# EAGLE design PowerDistribution (EAGLE 9.5.0)

## Sheet 1 of 3: Connectors
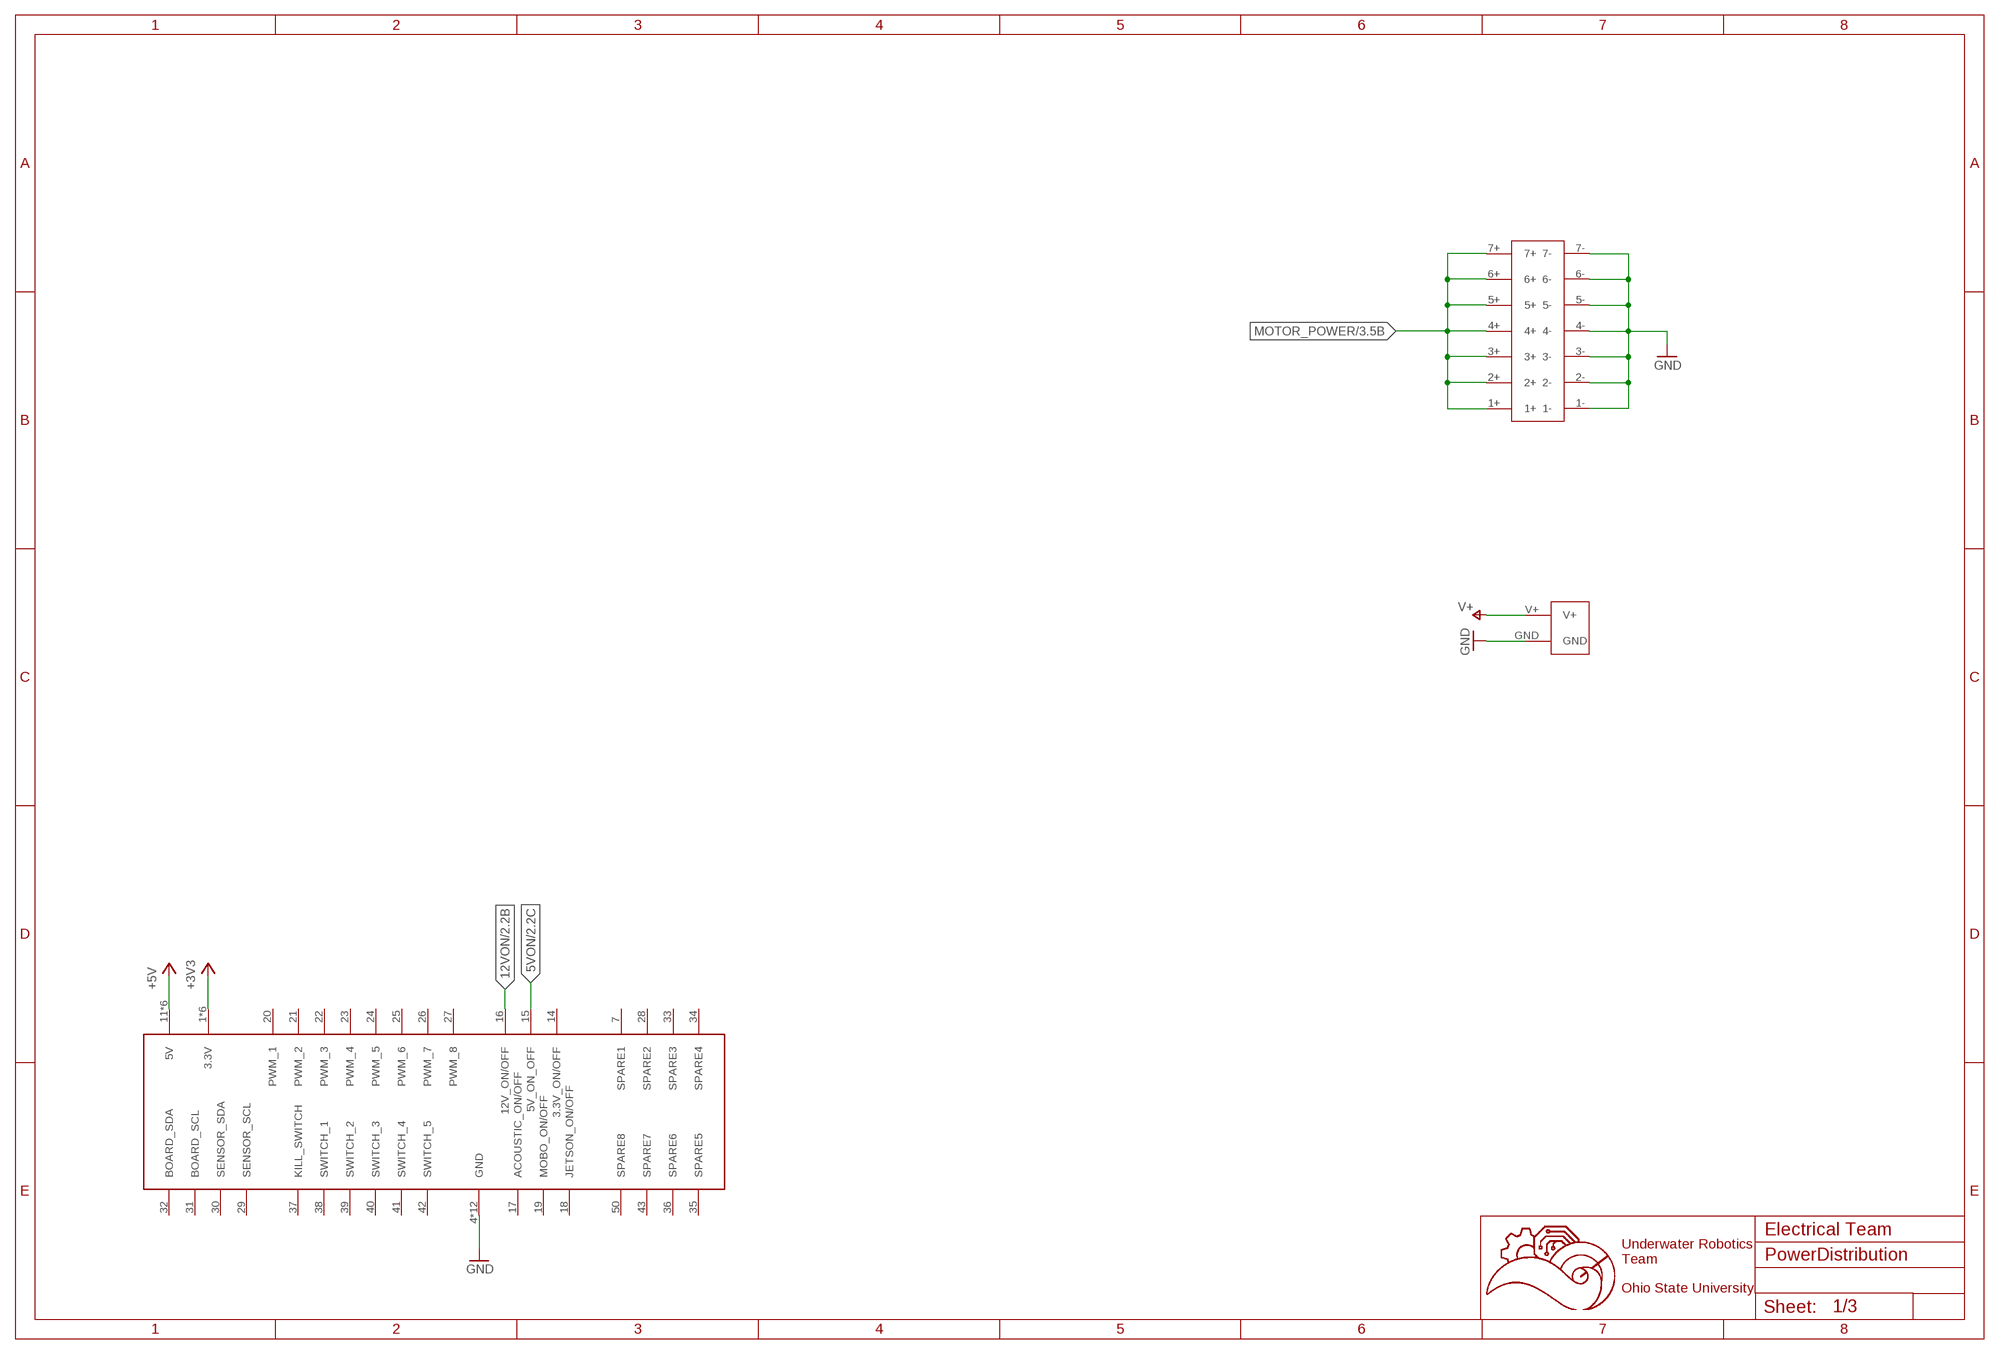
[diagram p0: schematic, sheet 1]

### Parts
U$1  5530843-EDGE  [5530843-6-BOARDFINGERS]
U$2  XT90PWH  [XT90PWH]
U$4  14PIN-VERT  [14PIN_VERT]

### Nets
5VON: U$1.15(5V_ON_OFF) ; also sheet 2
12VON: U$1.16(12V_ON/OFF) ; also sheet 2
+3V3: U$1.1(3.3V) U$1.2(3.3V) U$1.3(3.3V) U$1.54(3.3V) U$1.55(3.3V) U$1.56(3.3V) ; also sheet 2,3
+5V: U$1.11(5V) U$1.12(5V) U$1.13(5V) U$1.44(5V) U$1.45(5V) U$1.46(5V) ; also sheet 2
GND: U$1.4(GND) U$1.5(GND) U$1.6(GND) U$1.8(GND) U$1.9(GND) U$1.10(GND) U$1.47(GND) U$1.48(GND) U$1.49(GND) U$1.51(GND) U$1.52(GND) U$1.53(GND) U$2.GND U$4.1- U$4.2- U$4.3- U$4.4- U$4.5- U$4.6- U$4.7- ; also sheet 2
MOTOR_POWER: U$4.1+ U$4.2+ U$4.3+ U$4.4+ U$4.5+ U$4.6+ U$4.7+ ; also sheet 3
V+: U$2.V+ ; also sheet 2,3
Unconnected: U$1.7(SPARE1) U$1.14(3.3V_ON/OFF) U$1.17(ACOUSTIC_ON/OFF) U$1.18(JETSON_ON/OFF) U$1.19(MOBO_ON/OFF) U$1.20(PWM_1) U$1.21(PWM_2) U$1.22(PWM_3) U$1.23(PWM_4) U$1.24(PWM_5) U$1.25(PWM_6) U$1.26(PWM_7) U$1.27(PWM_8) U$1.28(SPARE2) U$1.29(SENSOR_SCL) U$1.30(SENSOR_SDA) U$1.31(BOARD_SCL) U$1.32(BOARD_SDA) U$1.33(SPARE3) U$1.34(SPARE4) U$1.35(SPARE5) U$1.36(SPARE6) U$1.37(KILL_SWITCH) U$1.38(SWITCH_1) U$1.39(SWITCH_2) U$1.40(SWITCH_3) U$1.41(SWITCH_4) U$1.42(SWITCH_5) U$1.43(SPARE7) U$1.50(SPARE8)

### Notes on the sheet
- Electrical Team
- Underwater Robotics
  Team
  
  Ohio State University

## Sheet 2 of 3: Converters
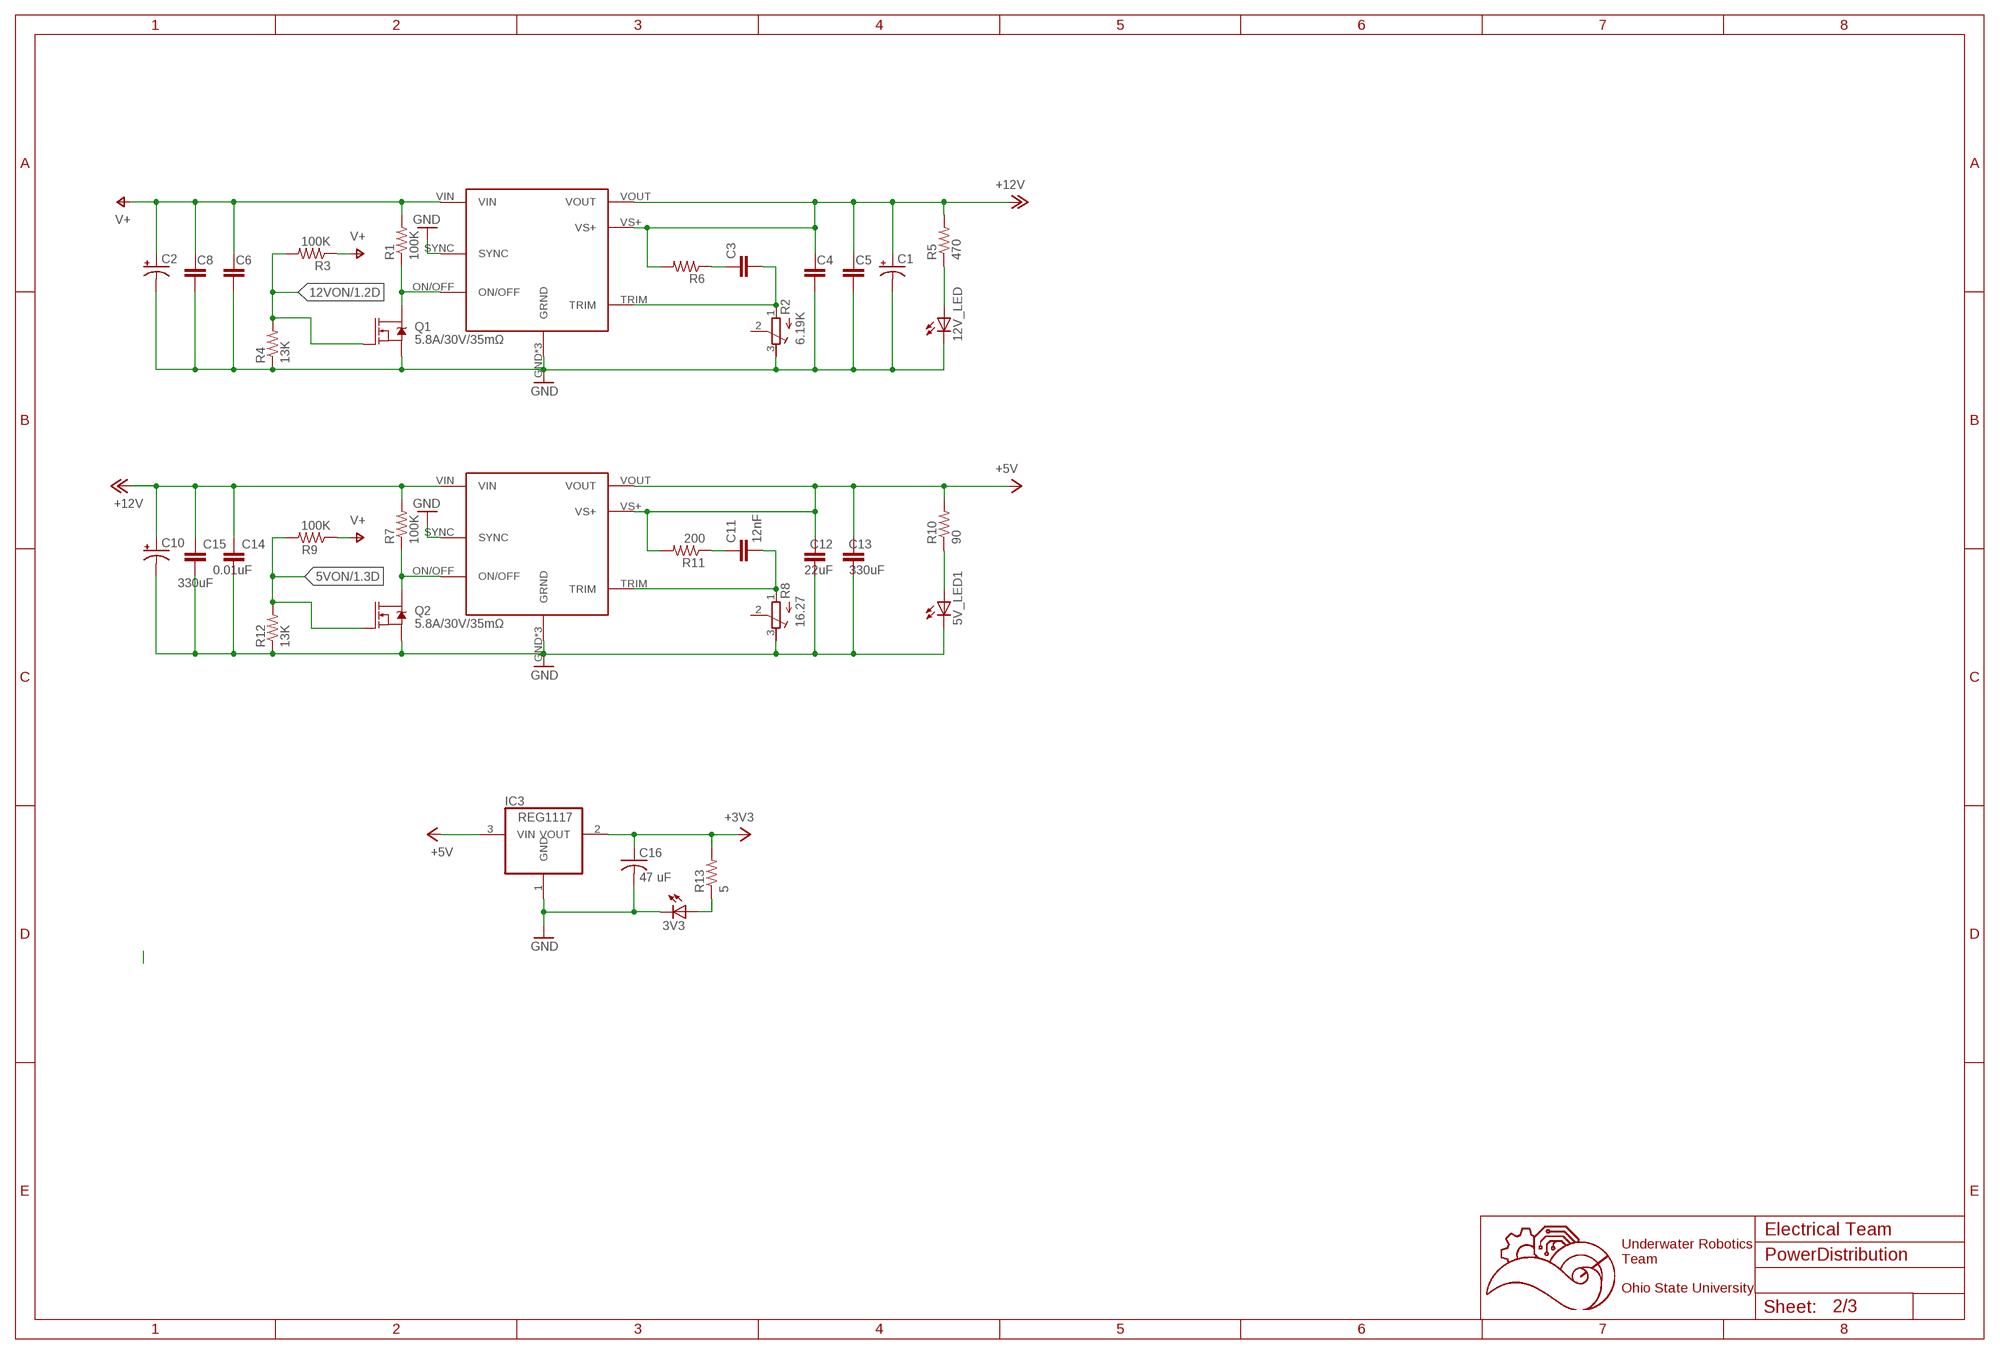
[diagram p1: schematic, sheet 2]

### Parts
3V3  LEDCHIPLED_0603  [CHIPLED_0603]
5V_LED1  LEDCHIPLED_0603  [CHIPLED_0603]
12V_LED  LEDCHIPLED_0603  [CHIPLED_0603]
C1  CPOL-USE5-10.5  [E5-10,5]
C2  47uF  CPOL-USE5-10.5  [E5-10,5]
C3  1.5nF  C-EUC0603  [C0603]
C4  22uF  C-EUC0603  [C0603]
C5  470uF  C-EUC0603  [C0603]
C6  0.01uF  C-EUC0603  [C0603]
C8  C-EUC0603  [C0603]
C10  47uF  CPOL-USE5-10.5  [E5-10,5]
C11  12nF  C-EUC0603  [C0603]
C12  22uF  C-EUC0603  [C0603]
C13  330uF  C-EUC0603  [C0603]
C14  0.01uF  C-EUC0603  [C0603]
C15  330uF  C-EUC0603  [C0603]
C16  47 uF  C-USC1206K  [C1206K]
IC3  REG1117  [SOT223]
Q1  5.8A/30V/35mΩ  MOSFET-NCH-AO3404A  [SOT23-3]
Q2  5.8A/30V/35mΩ  MOSFET-NCH-AO3404A  [SOT23-3]
R1  100K  R-US_R0603  [R0603]
R2  6.19K  R-TRIMM3103  [RTRIM3103]
R3  100K  R-US_R0603  [R0603]
R4  13K  R-US_R0603  [R0603]
R5  470  R-US_R0603  [R0603]
R6  200  R-US_R0603  [R0603]
R7  100K  R-US_R0603  [R0603]
R8  16.27  R-TRIMM3103  [RTRIM3103]
R9  100K  R-US_R0603  [R0603]
R10  90  R-US_R0603  [R0603]
R11  200  R-US_R0603  [R0603]
R12  13K  R-US_R0603  [R0603]
R13  5  R-US_R0603  [R0603]
U$3  DC_DC_CONVERTER  [DC_DC_CONVERTER]
U$5  DC_DC_CONVERTER  [DC_DC_CONVERTER]

### Nets
5VON: Q2.1(G) R9.2 R12.2 ; also sheet 1
12VON: Q1.1(G) R3.2 R4.2 ; also sheet 1
+3V3: C16.1 IC3.2(VOUT) R13.2 ; also sheet 1,3
+5V: C12.2 C13.2 IC3.3(VIN) R10.2 R11.2 U$5.VOUT U$5.VS+ ; also sheet 1
+12V: C1.+ C4.2 C5.2 C10.+ C14.2 C15.2 R5.2 R6.2 R7.2 U$3.VOUT U$3.VS+ U$5.VIN
GND: 3V3.C 5V_LED1.C 12V_LED.C C1.- C2.- C4.1 C5.1 C6.1 C8.1 C10.- C12.1 C13.1 C14.1 C15.1 C16.2 IC3.1(GND) Q1.2(S) Q2.2(S) R2.3(E) R4.1 R8.3(E) R12.1 U$3.GND2(GRND) U$3.GND3(GRND) U$3.GND(GRND) U$3.SYNC U$5.GND2(GRND) U$5.GND3(GRND) U$5.GND(GRND) U$5.SYNC ; also sheet 1
N$3: 12V_LED.A R5.1
N$4: C3.1 R6.1
N$5: Q1.3(D) R1.1 U$3.ON/OFF
N$6: C3.2 R2.1(A) U$3.TRIM
N$7: Q2.3(D) R7.1 U$5.ON/OFF
N$9: C11.2 R8.1(A) U$5.TRIM
N$10: 5V_LED1.A R10.1
N$11: C11.1 R11.1
N$28: 3V3.A R13.1
V+: C2.+ C6.2 C8.2 R1.2 R3.1 R9.1 U$3.VIN ; also sheet 1,3
Unconnected: R2.2(S) R8.2(S)

### Notes on the sheet
- Electrical Team
- Underwater Robotics
  Team
  
  Ohio State University

## Sheet 3 of 3: Motor Power
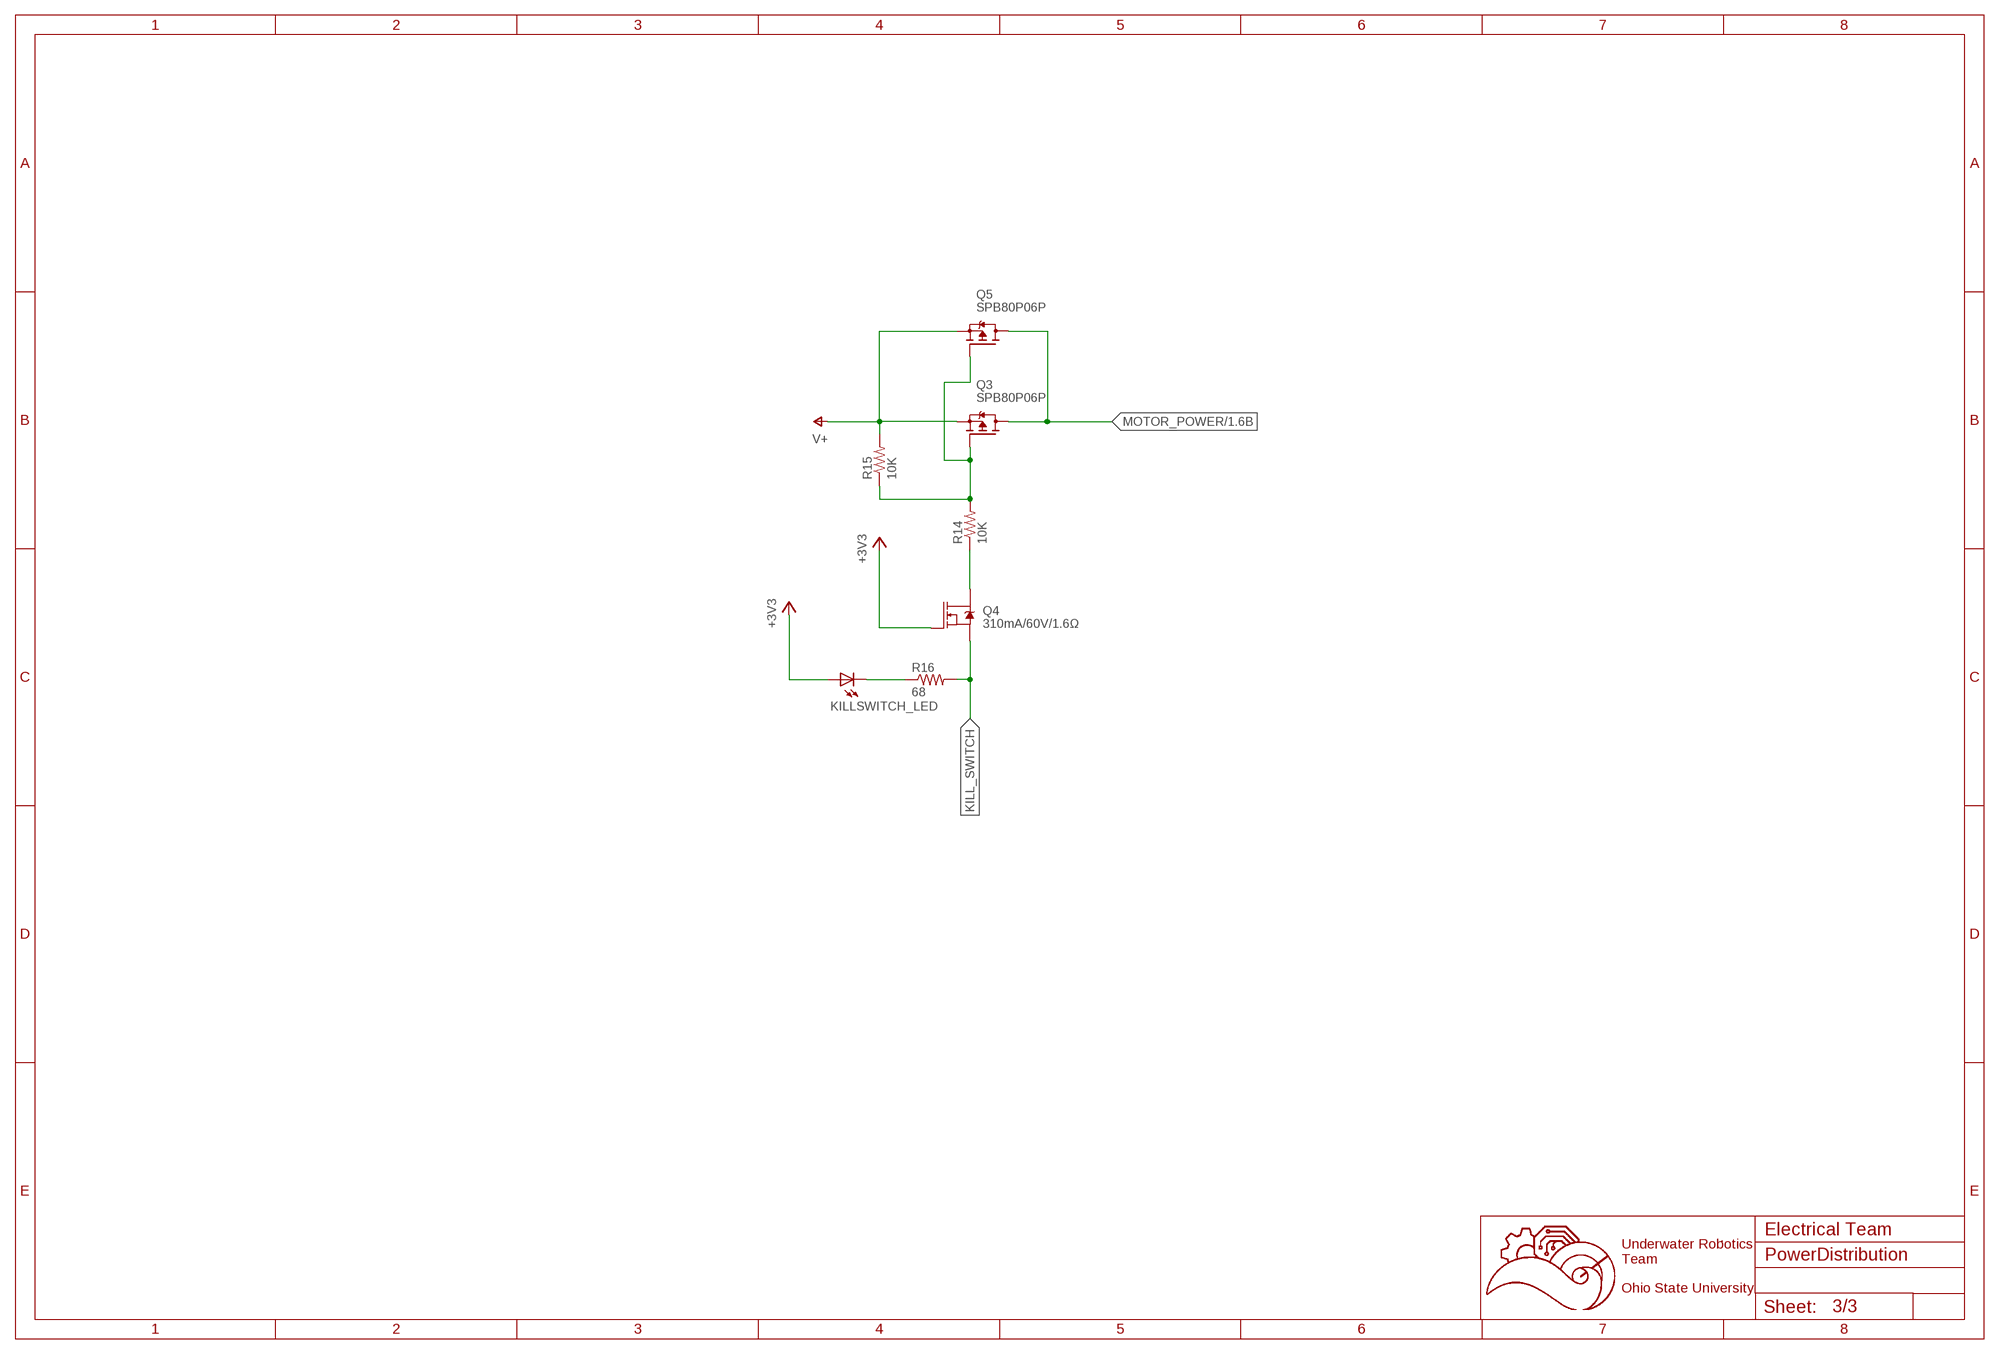
[diagram p2: schematic, sheet 3]

### Parts
KILLSWITCH_LED  LEDCHIP-LED0603  [CHIP-LED0603]
Q3  SPB80P06P  [TO263]
Q4  310mA/60V/1.6Ω  MOSFET-NCH-2N7002PW  [SOT323]
Q5  SPB80P06P  [TO263]
R14  10K  R-US_R0603  [R0603]
R15  10K  R-US_R0603  [R0603]
R16  68  R-US_R0603  [R0603]

### Nets
+3V3: KILLSWITCH_LED.A Q4.1(G) ; also sheet 1,2
KILL_SWITCH: Q4.2(S) R16.2
MOTOR_POWER: Q3.3(D) Q5.3(D) ; also sheet 1
N$1: Q4.3(D) R14.1
N$8: Q3.1(G) Q5.1(G) R14.2 R15.1
N$16: KILLSWITCH_LED.C R16.1
V+: Q3.2(S) Q5.2(S) R15.2 ; also sheet 1,2

### Notes on the sheet
- Electrical Team
- Underwater Robotics
  Team
  
  Ohio State University

## Library data of the parts
3V3 5V_LED1 12V_LED KILLSWITCH_LED = led:LED: LED OSRAM: - CHIPLED LG R971, LG N971, LY N971, LG Q971, LY Q971, LO R971, LY R971 LH N974, LH R974 LS Q976, LO Q976, LY Q976 LO Q996 - Hyper CHIPLED LW Q18S LB Q993, LB Q99A, LB R99A - SideLED LS A670, LO A670, LY A670, LG A670, LP A670 LB A673, LV A673, LT A673, LW A673 LH A674 LY A675 LS A676, LA A676, LO A676, LY A676, LW A676 LS A679, LY A679, LG A679 - Hyper Micro SIDELED® LS Y876, LA Y876, LO Y876, LY Y876 LT Y87S - SmartLED LW L88C, LW L88S LB L89C, LB L89S, LG L890 LS L89K, LO L89K, LY L89K LS L896, LA L896, LO L896, LY L896 - TOPLED LS T670, LO T670, LY T670, LG T670, LP T670 LSG T670, LSP T670, LSY T670, LOP T670, LYG T670 LG T671, LOG T671, LSG T671 LB T673, LV T673, LT T673, LW T673 LH T674 LS T676, LA T676, LO T676, LY T676, LB T676, LH T676, LSB T676, LW T676 LB T67C, LV T67C, LT T67C, LS T67K, LO T67K, LY T67K, LW E67C LS E67B, LA E67B, LO E67B, LY E67B, LB E67C, LV E67C, LT E67C LW T67C LS T679, LY T679, LG T679 LS T770, LO T770, LY T770, LG T770, LP T770 LB T773, LV T773, LT T773, LW T773 LH T774 LS E675, LA E675, LY E675, LS T675 LS T776, LA T776, LO T776, LY T776, LB T776 LHGB T686 LT T68C, LB T68C - Hyper Mini TOPLED® LB M676 - Mini TOPLED Santana® LG M470 LS M47K, LO M47K, LY M47K Source: http://www.osram.convergy.de LUXEON: - LUMILED® LXK2-PW12-R00, LXK2-PW12-S00, LXK2-PW14-U00, LXK2-PW14-V00 LXK2-PM12-R00, LXK2-PM12-S00, LXK2-PM14-U00 LXK2-PE12-Q00, LXK2-PE12-R00, LXK2-PE12-S00, LXK2-PE14-T00, LXK2-PE14-U00 LXK2-PB12-K00, LXK2-PB12-L00, LXK2-PB12-M00, LXK2-PB14-N00, LXK2-PB14-P00, LXK2-PB14-Q00 LXK2-PR12-L00, LXK2-PR12-M00, LXK2-PR14-Q00, LXK2-PR14-R00 LXK2-PD12-Q00, LXK2-PD12-R00, LXK2-PD12-S00 LXK2-PH12-R00, LXK2-PH12-S00 LXK2-PL12-P00, LXK2-PL12-Q00, LXK2-PL12-R00 Source: www.luxeon.com KINGBRIGHT: KA-3528ASYC Source: www.kingbright.com
C1 C2 C10 = adafruit:CPOL-US: POLARIZED CAPACITOR, American symbol
C3-C6 C8 C11-C15 = rcl:C-EU: CAPACITOR, European symbol; SPICEPREFIX: C
C16 = resistor:C-US: CAPACITOR, American symbol
IC3 = burr-brown:REG1117: 800mA and 1A Low Dropout (LDO) Positive Regulator 1.8V, 2.5V, 2.85V, 3.3V, 5V, and Adj; MPN: REG1117; OC_FARNELL: 1097566; OC_NEWARK: 14P6981
Q1 Q2 = SparkFun-DiscreteSemi:MOSFET-NCH: N-channel MOSFETs Voltage controlled devices that allow control of high current outputs. SparkFun Products: SparkFun OpenScale <https://www.sparkfun.com/products/13261> SparkFun Digital Sandbox <https://www.sparkfun.com/products/12651> SparkFun Monster Moto Shield <https://www.sparkfun.com/products/10182> SparkFun MOSFET Power Controller <https://www.sparkfun.com/products/11214>; PROD_ID: TRANS-12988
Q3 Q5 = transistor-fet:SPB80P06P: SIPMOS (R) Power-Transistor P-Channel, Enhancement mode Source: http://www.infineon.com/upload/Document/cmc_upload/documents/011/3685/SPP80P06P.pdf
Q4 = SparkFun-DiscreteSemi:MOSFET-NCH: N-channel MOSFETs Voltage controlled devices that allow control of high current outputs. SparkFun Products: SparkFun OpenScale <https://www.sparkfun.com/products/13261> SparkFun Digital Sandbox <https://www.sparkfun.com/products/12651> SparkFun Monster Moto Shield <https://www.sparkfun.com/products/10182> SparkFun MOSFET Power Controller <https://www.sparkfun.com/products/11214>; PROD_ID: TRANS-11151
R1 R3-R7 R9-R12 = audio amplifier example:R-US_: RESISTOR, American symbol
R2 R8 = resistor:R-TRIMM: Trimm resistor
R13-R16 = rcl:R-US_: RESISTOR, American symbol; SPICEPREFIX: R
U$1 = 5530843-6:5530843-EDGE
U$2 = XT90:XT90PWH
U$3 U$5 = DC_DC_CONVERTER:DC_DC_CONVERTER
U$4 = Vertical_Connectors:14PIN-VERT

## Board
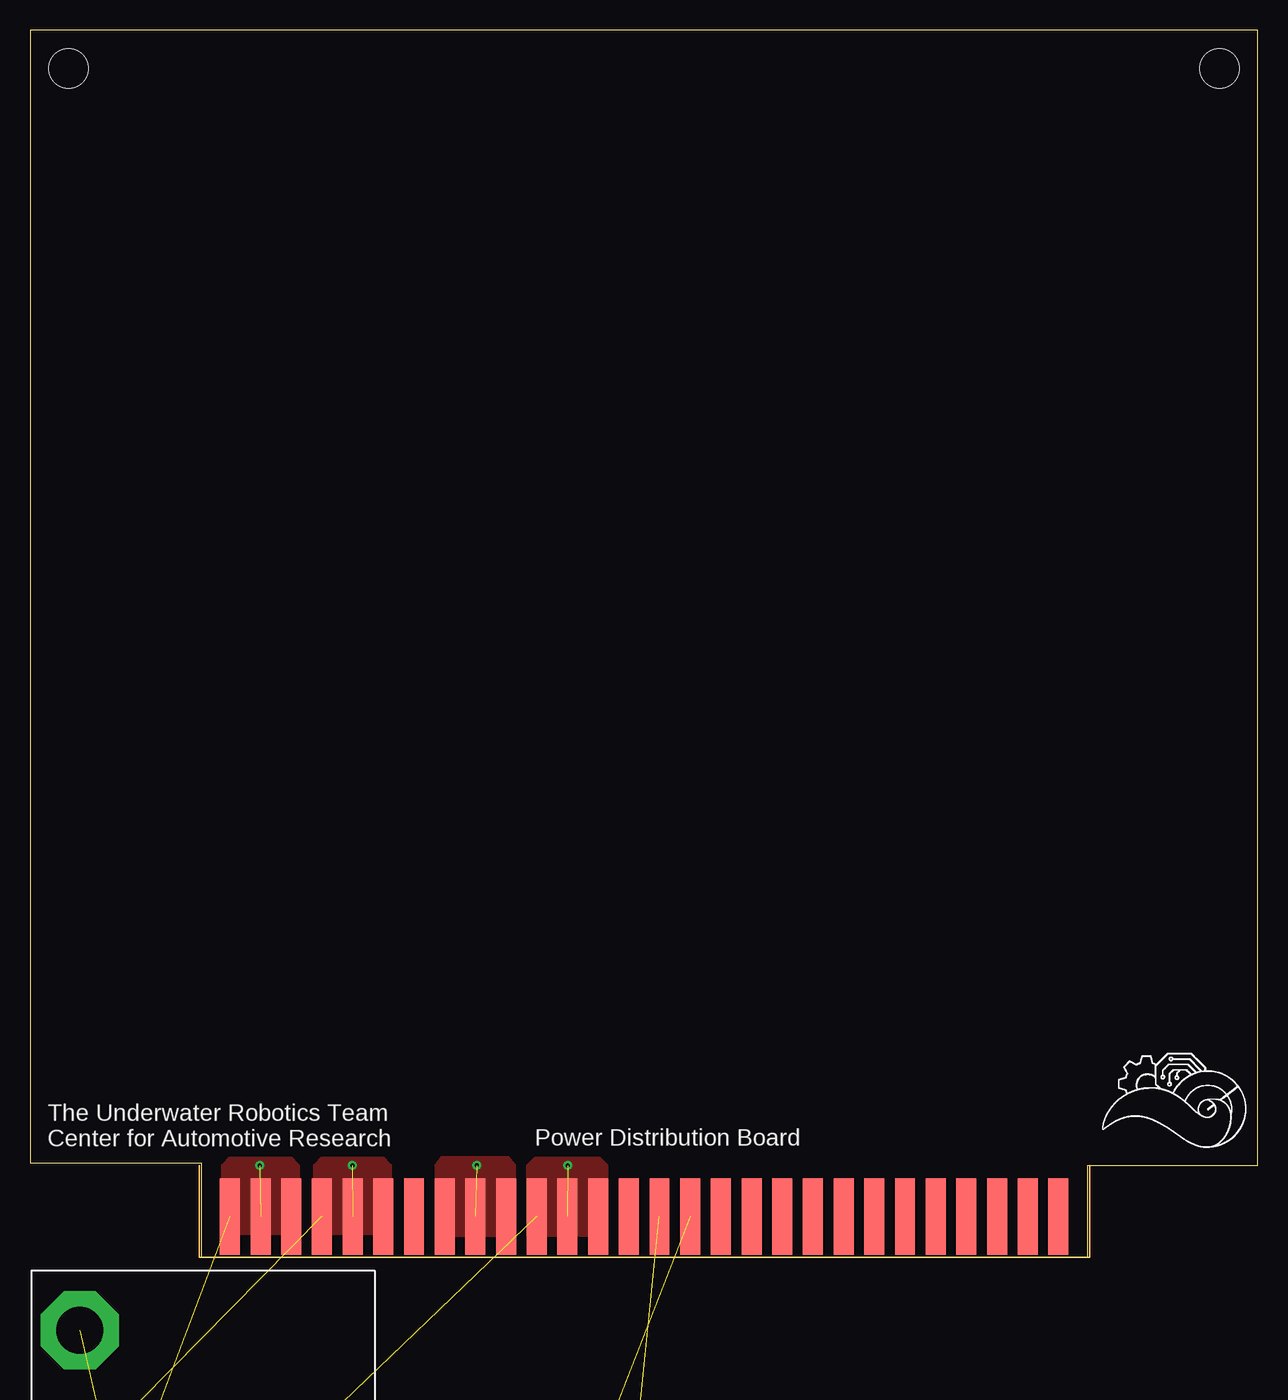
[diagram p3: board, top side]
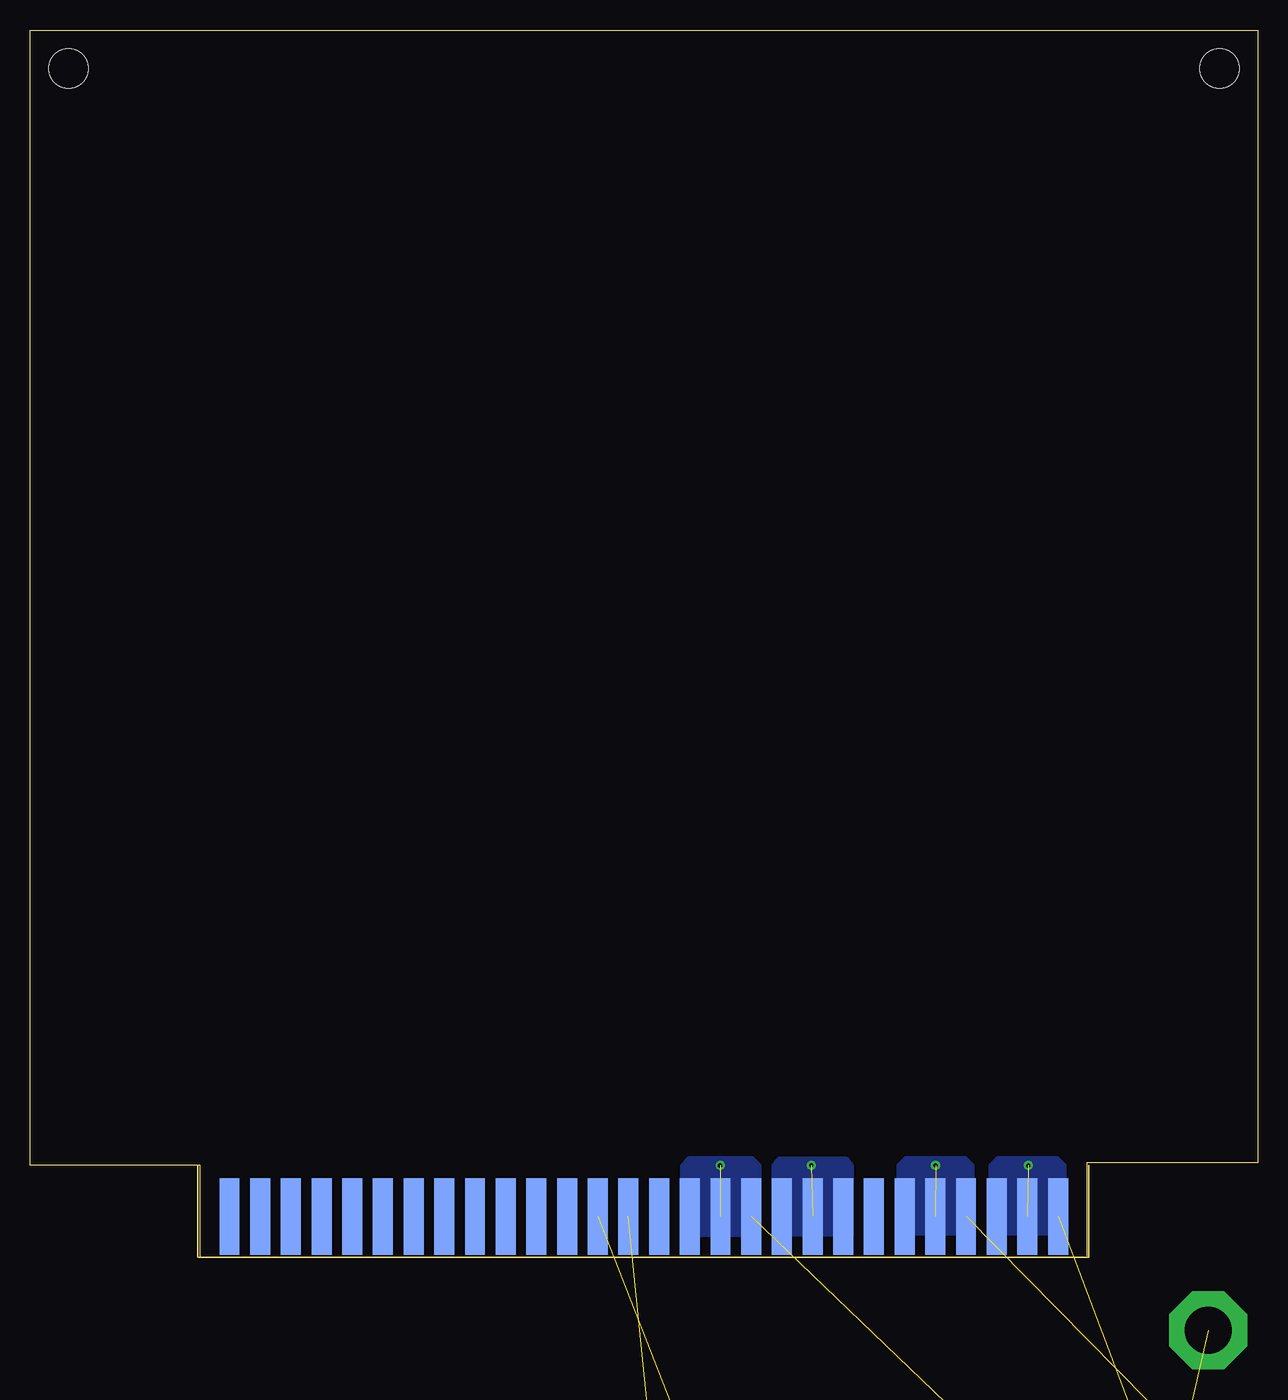
[diagram p4: board, bottom side, seen from below]

Size 101.6 x 101.6 mm. Coordinates in mm from the lower left corner, seen from the top.
Outline: 0,7.8 13.66,7.8 14.14,7.8 14.14,0 87.53,0 87.53,7.62 101.6,7.62 101.6,101.6 0,101.6 0,7.8
Copper layers (1*16): Top 0.035mm / dielectric 1.5mm / Bottom 0.035mm
Design rules "default *": minimum track width 6mil, minimum drill 0.35mm, track to track 6mil, track to pad 6mil, pad to pad 6mil, via to via 6mil, smd to smd 6mil, copper to edge 0.00508125mm, drill to drill 6mil, minimum pad ring 10mil, minimum via ring 8mil, stop-mask expansion 4mil, vias tented up to drill 0mil, thermal gap 10mil
Holes 3.26 mm at 3.17,98.42 98.42,98.42

### Footprints (pad centres in the part's own frame; a part is rotated, then mirrored left to right if it is on the bottom)
CHIPLED_0603 = smd 0.8 x 0.8: A 0,-0.75; C 0,0.75
E5-10,5 = drill 1.016 pad 2.54: + -2.54,0 | drill 1.016 pad 2.54 octagon: - 2.54,0
C0603 = smd 1.1 x 1: 1 -0.85,0; 2 0.85,0
C1206K = smd 1.5 x 2: 1 -1.5,0; 2 1.5,0
SOT223 = smd 1.499 x 2.007: 1 -2.261,-3.15; 2 0.025,-3.15; 3 2.311,-3.15 | smd 3.81 x 2.007: 4 0,3.15
CHIP-LED0603 = smd 0.8 x 0.8: A 0,-0.75; C 0,0.75
SOT23-3 = smd 0.8 x 0.9: 1 -0.95,-1; 2 0.95,-1; 3 0,1.1
TO263 = smd 1 x 3.4: 1 -2.54,-6.6; 2 2.54,-6.6 | smd 6.8 x 9.6: 3 0,3.5
SOT323 = smd 0.7 x 0.7: 1 -0.65,-0.925; 2 0.65,-0.925; 3 0,0.925
R0603 = smd 1 x 1.1: 1 -0.85,0; 2 0.85,0
RTRIM3103 = smd 1.2 x 1.25: 1 -1,-1.225; 3 1,-1.225 | smd 1.3 x 1.3: 2 0,1.3
5530843-6-BOARDFINGERS = smd 1.651 x 6.35 bottom: 1 0.826,3.375; 2 3.365,3.375; 3 5.905,3.375; 4 8.445,3.375; 5 10.986,3.375; 6 13.525,3.375; 7 16.066,3.375; 8 18.605,3.375; 9 21.145,3.375; 10 23.686,3.375; 11 26.226,3.375; 12 28.765,3.375; 13 31.305,3.375; 14 33.846,3.375; 15 36.386,3.375; 16 38.925,3.375; 17 41.465,3.375; 18 44.005,3.375; 19 46.545,3.375; 20 49.086,3.375; 21 51.626,3.375; 22 54.166,3.375; 23 56.706,3.375; 24 59.245,3.375; 25 61.785,3.375; 26 64.326,3.375; 27 66.865,3.375; 28 69.406,3.375 | smd 1.651 x 6.35: 29 69.406,3.375; 30 66.865,3.375; 31 64.326,3.375; 32 61.785,3.375; 33 59.245,3.375; 34 56.706,3.375; 35 54.166,3.375; 36 51.626,3.375; 37 49.086,3.375; 38 46.545,3.375; 39 44.005,3.375; 40 41.465,3.375; 41 38.925,3.375; 42 36.386,3.375; 43 33.846,3.375; 44 31.305,3.375; 45 28.765,3.375; 46 26.226,3.375; 47 23.686,3.375; 48 21.145,3.375; 49 18.605,3.375; 50 16.066,3.375; 51 13.525,3.375; 52 10.986,3.375; 53 8.445,3.375; 54 5.905,3.375; 55 3.365,3.375; 56 0.826,3.375
XT90PWH = drill 3.9 pad 6.452 square: GND 0,-5.45 | drill 3.9 pad 6.452 octagon: V+ 0,5.45
DC_DC_CONVERTER = smd 2.03 x 2.03: GND 1.27,4.95; ON/OFF 1.27,1.91; TRIM 13.27,12.15; VS+ 8.76,12.19 | smd 4.45 x 2.92: GND2 23.69,11.75; VOUT 17.97,11.75 | smd 3.68 x 2.03: GND3 30.94,4.19 | smd 1.52 x 1.52: SYNC 31.75,6.99 | smd 3.43 x 2.16: VIN 30.8,1.33 | hole 1.52: 3.12,5.61; 20.7,9.68; 26.8,10.31; 29.08,6.07; 28.32,0.97
14PIN_VERT = drill 1.4 square: 1+ 0,0; 1- 5.5,0; 2+ 0,4.2; 2- 5.5,4.2; 3+ 0,8.4; 3- 5.5,8.4; 4+ 0,12.6; 4- 5.5,12.6; 5+ 0,16.8; 5- 5.5,16.8; 6+ 0,21; 6- 5.5,21; 7+ 0,25.2; 7- 5.5,25.2

### Placement (x,y rotation side)
3V3  12,-37 0 top  (outside the outline)
5V_LED1  -5.8,-268.8 0 top  (outside the outline)
12V_LED  -5.8,-178 0 top  (outside the outline)
C1  4.3,-130 0 top  (outside the outline)
C2  -3.1,-145.6 0 top  (outside the outline)
C3  -6.8,-187.6 0 top  (outside the outline)
C4  -6.8,-191.1 0 top  (outside the outline)
C5  -6.8,-194.6 0 top  (outside the outline)
C6  -6.8,-198.1 0 top  (outside the outline)
C8  -6.8,-201.6 0 top  (outside the outline)
C10  -3.1,-290.4 0 top  (outside the outline)
C11  11,-305.1 0 top  (outside the outline)
C12  17,-305.1 0 top  (outside the outline)
C13  4.5,-305.1 0 top  (outside the outline)
C14  -2.5,-305.1 0 top  (outside the outline)
C15  -6.8,-310.5 0 top  (outside the outline)
C16  2.4,-37.2 0 top  (outside the outline)
IC3  3.4,-28.2 0 top  (outside the outline)
KILLSWITCH_LED  -5.8,-346.3 0 top  (outside the outline)
Q1  -5.7,-152.6 0 top  (outside the outline)
Q2  -5.7,-299.1 0 top  (outside the outline)
Q3  -2.3,-322 0 top  (outside the outline)
Q4  -2.6,-334.8 0 top  (outside the outline)
Q5  9.7,-322 0 top  (outside the outline)
R1  0.6,-137.9 0 top  (outside the outline)
R2  -4.6,-138 0 top  (outside the outline)
R3  -6.8,-158.9 0 top  (outside the outline)
R4  -6.8,-254 0 top  (outside the outline)
R5  -6.8,-169.5 0 top  (outside the outline)
R6  -6.8,-182.5 0 top  (outside the outline)
R7  5.7,-298.3 0 top  (outside the outline)
R8  0.5,-298.9 0 top  (outside the outline)
R9  11,-298.3 0 top  (outside the outline)
R10  16.3,-298.3 0 top  (outside the outline)
R11  -6.8,-305.4 0 top  (outside the outline)
R12  20.7,-298.3 0 top  (outside the outline)
R13  6.4,-37.1 0 top  (outside the outline)
R14  1,-333.5 0 top  (outside the outline)
R15  5.7,-333.5 0 top  (outside the outline)
R16  10.4,-333.5 0 top  (outside the outline)
U$1  15.7,0 0 top
U$2  4.1,-11.5 0 top  (outside the outline)
U$3  0.1,-123.8 0 top  (outside the outline)
U$4  2.8,-107.4 0 top  (outside the outline)
U$5  -7.3,-284.2 0 top  (outside the outline)

### Tracks (layer width: path | path; a pad name or v marks a point on that pad's centre or on a via)
5VON  (3 unrouted)
12VON  (3 unrouted)
+3V3  (via drill 0.35)  (6 unrouted)
  other vias: 19,7.6
  pour Bottom (no thermals): 15.88,7.62 16.51,8.26 21.59,8.26 22.23,7.62 22.23,1.91 15.88,1.91
  pour Top (no thermals): 15.88,7.62 16.51,8.26 21.59,8.26 22.23,7.62 22.23,1.91 15.88,1.91
+5V  (via drill 0.35)  (8 unrouted)
  other vias: 44.5,7.6
  pour Top (no thermals): 41.15,1.78 41.15,7.62 41.78,8.26 47.12,8.26 47.75,7.62 47.75,1.78
  pour Bottom (no thermals): 41.15,1.78 41.15,7.62 41.78,8.26 47.12,8.26 47.75,7.62 47.75,1.78
+12V  (11 unrouted)
GND  (via drill 0.35)  (40 unrouted)
  other vias: 26.67,7.62 36.96,7.62
  pour Top (no thermals): 23.5,7.62 24.13,8.26 29.21,8.26 29.84,7.62 29.84,1.91 23.5,1.91
  pour Bottom (no thermals): 23.5,7.62 24.13,8.26 29.21,8.26 29.84,7.62 29.84,1.91 23.5,1.91
  pour Top (no thermals): 33.66,1.78 40.13,1.78 40.13,7.62 39.62,8.26 34.04,8.26 33.53,7.62 33.53,1.91
  pour Bottom (no thermals): 33.53,7.62 33.53,1.91 33.66,1.78 40.01,1.78 40.01,4.06 40.01,5.71 40.13,5.84 40.13,7.62 39.62,8.26 34.04,8.26
KILL_SWITCH  (1 unrouted)
MOTOR_POWER  (8 unrouted)
N$1  (1 unrouted)
N$3  (1 unrouted)
N$4  (1 unrouted)
N$5  (2 unrouted)
N$6  (2 unrouted)
N$7  (2 unrouted)
N$8  (3 unrouted)
N$9  (2 unrouted)
N$10  (1 unrouted)
N$11  (1 unrouted)
N$16  (1 unrouted)
N$28  (1 unrouted)
V+  (10 unrouted)

### Text on the board
tPlace: The Underwater Robotics Team / Center for Automotive Research | Power Distribution Board